# Altium schematic sheet 输入模块.SchDoc
size A4
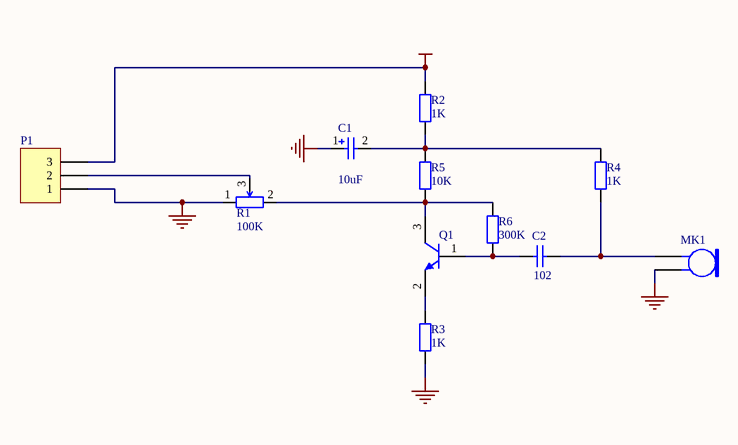
[diagram p0: 输入模块.SchDoc]

## Parts
C1  value 10uF  [C-DJ-6]  (hidden comment: DJDR)
C2  value 102  [TP-0805-R]  (hidden comment: CPDR)
MK1  MKF  [JK128_2]  (value not drawn)
P1  Header 3  [HDR-3]  (value not drawn)
Q1  TPSJG_NPN  [BCY-W3/E4]  (value not drawn)
R1  value 100K  [SIP3-D]  (hidden comment: Res _JT)
R2  value 1K  [TP-0805-R]  (hidden comment: Res)
R3  value 1K  [TP-0805-R]  (hidden comment: Res)
R4  value 1K  [TP-0805-R]  (hidden comment: Res)
R5  value 10K  [TP-0805-R]  (hidden comment: Res)
R6  value 300K  [TP-0805-R]  (hidden comment: Res)

## Nets
GND: C1.1 MK1.2 P1.1 R1.1 R3.1
VCC: P1.3 R2.2
NetC1_2: C1.2 R2.1 R4.2 R5.2
NetC2_1: C2.1 Q1.1(B) R6.1
NetC2_2: C2.2 MK1.1 R4.1
NetP1_2: P1.2 R1.3
NetQ1_2: Q1.2(E) R3.2
NetQ1_3: Q1.3(C) R1.2 R5.1 R6.2

## Library data of the parts
C1 = DJDR: 电解电容; Published: 8-Jun-2000; LatestRevisionDate: 17-Jul-2002; LatestRevisionNote: Re-released for DXP Platform.; Publisher: Altium Limited
C2 = CPDR: 瓷片电容; Published: 8-Jun-2000; LatestRevisionDate: 17-Jul-2002; LatestRevisionNote: Re-released for DXP Platform.; Publisher: Altium Limited
MK1 = MKF: 麦克风; Published: 24-Mar-1999; LatestRevisionDate: 17-Jul-2002; LatestRevisionNote: Re-released for DXP Platform.; Publisher: Altium Limited
P1 = Header 3: Header, 3-Pin; LatestRevisionDate: 17-Jul-2002; LatestRevisionNote: Re-released for DXP Platform.; Publisher: Altium Limited
Q1 = TPSJG_NPN: 贴片三极管——NPN; Published: 8-Jun-2000; LatestRevisionDate: 15-Jan-2003; LatestRevisionNote: PCB Footprint 'BCY-W3/D4.7' replaced; DatasheetDocument: 1997; PackageReference: TO-92A; Publisher: Altium Limited; Code_JEDEC: TO-92A
R1 = Res _JT: j精调电阻; Set Position: 0.5; Published: 8-Jun-2000; LatestRevisionDate: 17-Jul-2002; LatestRevisionNote: Re-released for DXP Platform.; Publisher: Altium Limited
R2-R6 = Res: 电阻; Published: 8-Jun-2000; LatestRevisionDate: 17-Jul-2002; LatestRevisionNote: Re-released for DXP Platform.; Publisher: Altium Limited